# Altium schematic sheet charger_1A.SchDoc
size A4
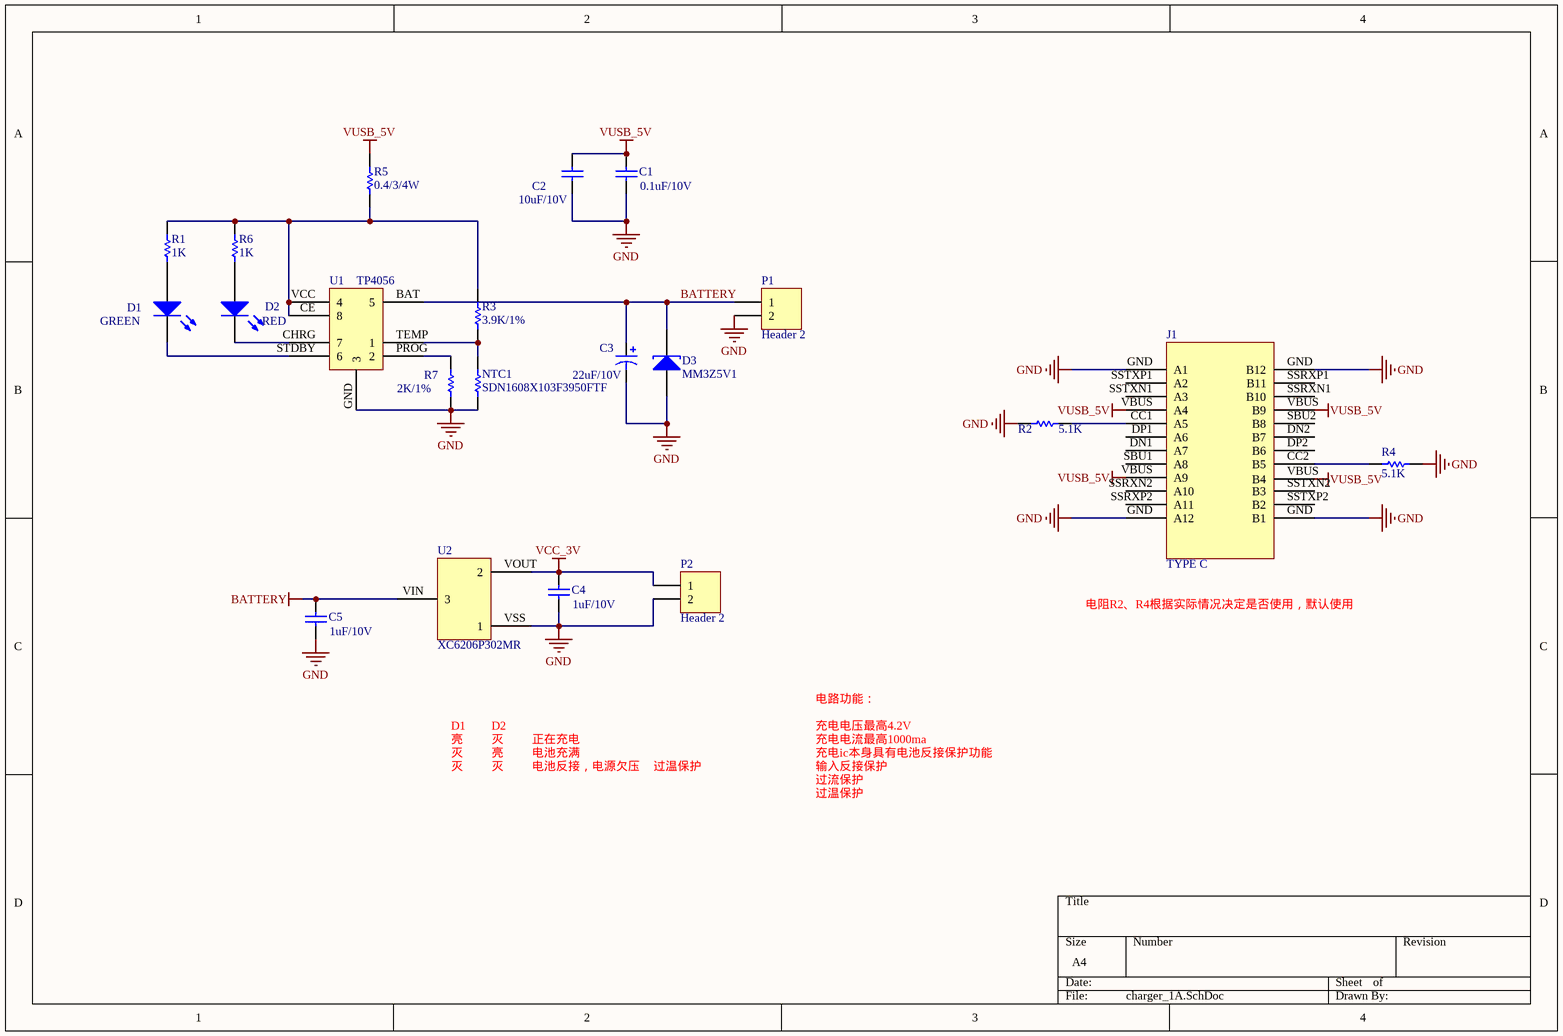
[diagram p0: charger_1A.SchDoc]

## Parts
C1  0.1uF/10V  [0603C]
C2  10uF/10V  [0603C]
C3  22uF/10V  [1210E]
C4  1uF/10V  [0603C]
C5  1uF/10V  [0603C]
D1  Publisher: GREEN  [0603LED]
D2  Publisher: RED  [0603LED]
D3  MM3Z5V1  [SOD323]
J1  TYPE C
NTC1  SDN1608X103F3950FTF  [0603R]
P1  Header 2  [HDR1X2]
P2  Header 2  [HDR1X2]
R1  1K  [0603R]
R2  5.1K  [0603R]
R3  3.9K/1%  [0603R]
R4  5.1K  [0603R]
R5  0.4/3/4W  [0603R]
R6  1K  [0603R]
R7  2K/1%  [0603R]
U1  TP4056
U2  XC6206P302MR

## Nets
BATTERY: C3.1 C5.2 D3.2(K) P1.1 U1.BAT(5) U2.VIN(3)
GND: C1.1 C2.1 C3.2 C4.1 C5.1 D3.1(A) J1.GND(A1) NTC1.2 P1.2 P2.2 R2.2 R4.2 R7.1 U1.GND(3) U2.VSS(1)
VCC_3V: C4.2 P2.1 U2.VOUT(2)
VUSB_5V: C1.2 C2.2 J1.VBUS(A4) R5.1
NetD1_1: D1.1(A) R1.1
NetD1_2: D1.2(K) U1.STDBY(6)
NetD2_1: D2.1(A) R6.1
NetD2_2: D2.2(K) U1.CHRG(7)
NetJ1_CC1: J1.CC1(A5) R2.1
NetJ1_CC2: J1.CC2(B5) R4.1
NetNTC1_1: NTC1.1 R3.2 U1.TEMP(1)
NetR1_2: R1.2 R3.1 R5.2 R6.2 U1.CE(8) U1.VCC(4)
NetR7_2: R7.2 U1.PROG(2)

Not connected (* = marked no-connect by the designer): J1 DN1(A7) DN2(B7) DP1(A6) DP2(B6) SBU1(A8) SBU2(B8) SSRXN1(B10) SSRXN2(A10) SSRXP1(B11) SSRXP2(A11) SSTXN1(A3) SSTXN2(B3) SSTXP1(A2) SSTXP2(B2)

## Notes on the sheet
- 电阻R2、R4根据实际情况决定是否使用，默认使用
- 电路功能：
- D1
- 亮
- 灭
- D2
- 正在充电
- 电池充满
- 电池反接，电源欠压
- 过温保护
- 充电ic本身具有电池反接保护功能
- 输入反接保护
- 充电电流最高1000ma
- 充电电压最高4.2V
- 过流保护

## Library data of the parts
C1 C2 C4 C5 = Cap: Capacitor; Value: 100pF; Published: 8-Jun-2000; LatestRevisionDate: 17-Jul-2002; LatestRevisionNote: Re-released for DXP Platform.; PackageReference: RAD-0.3; Publisher: Altium Limited
C3 = Cap Pol1: Polarized Capacitor (Radial); Value: 100pF; Published: 8-Jun-2000; LatestRevisionDate: 17-Jul-2002; LatestRevisionNote: Re-released for DXP Platform.; PackageReference: RB7.6-15; Publisher: Altium Limited
D1 D2 = LED0: Typical INFRARED GaAs LED; Published: 8-Jun-2000; LatestRevisionDate: 08-Jul-2005; LatestRevisionNote: Mech Layer 1 removed.; PackageReference: LED-0
D3 = D Tunnel1: Tunnel Diode - RLC Model; Published: 8-Jun-2000; LatestRevisionDate: 17-Jul-2002; LatestRevisionNote: Re-released for DXP Platform.; PackageVersion: Feb-2002; PackageReference: 3.2X1.6X1.1; Publisher: Altium Limited
NTC1 R2-R5 R7 = Res Semi: Semiconductor Resistor; Value: 1K; Published: 8-Jun-2000; LatestRevisionDate: 17-Jul-2002; LatestRevisionNote: Re-released for DXP Platform.; PackageReference: AXIAL-0.5; Publisher: Altium Limited
P1 P2 = Header 2: Header, 2-Pin; LatestRevisionDate: 17-Jul-2002; LatestRevisionNote: Re-released for DXP Platform.; Publisher: Altium Limited
R1 R6 = Res Semi: Semiconductor Resistor; Published: 8-Jun-2000; LatestRevisionDate: 17-Jul-2002; LatestRevisionNote: Re-released for DXP Platform.; PackageReference: AXIAL-0.5; Publisher: Altium Limited; Value: 1K